# Altium project main board_Project.PrjPCB
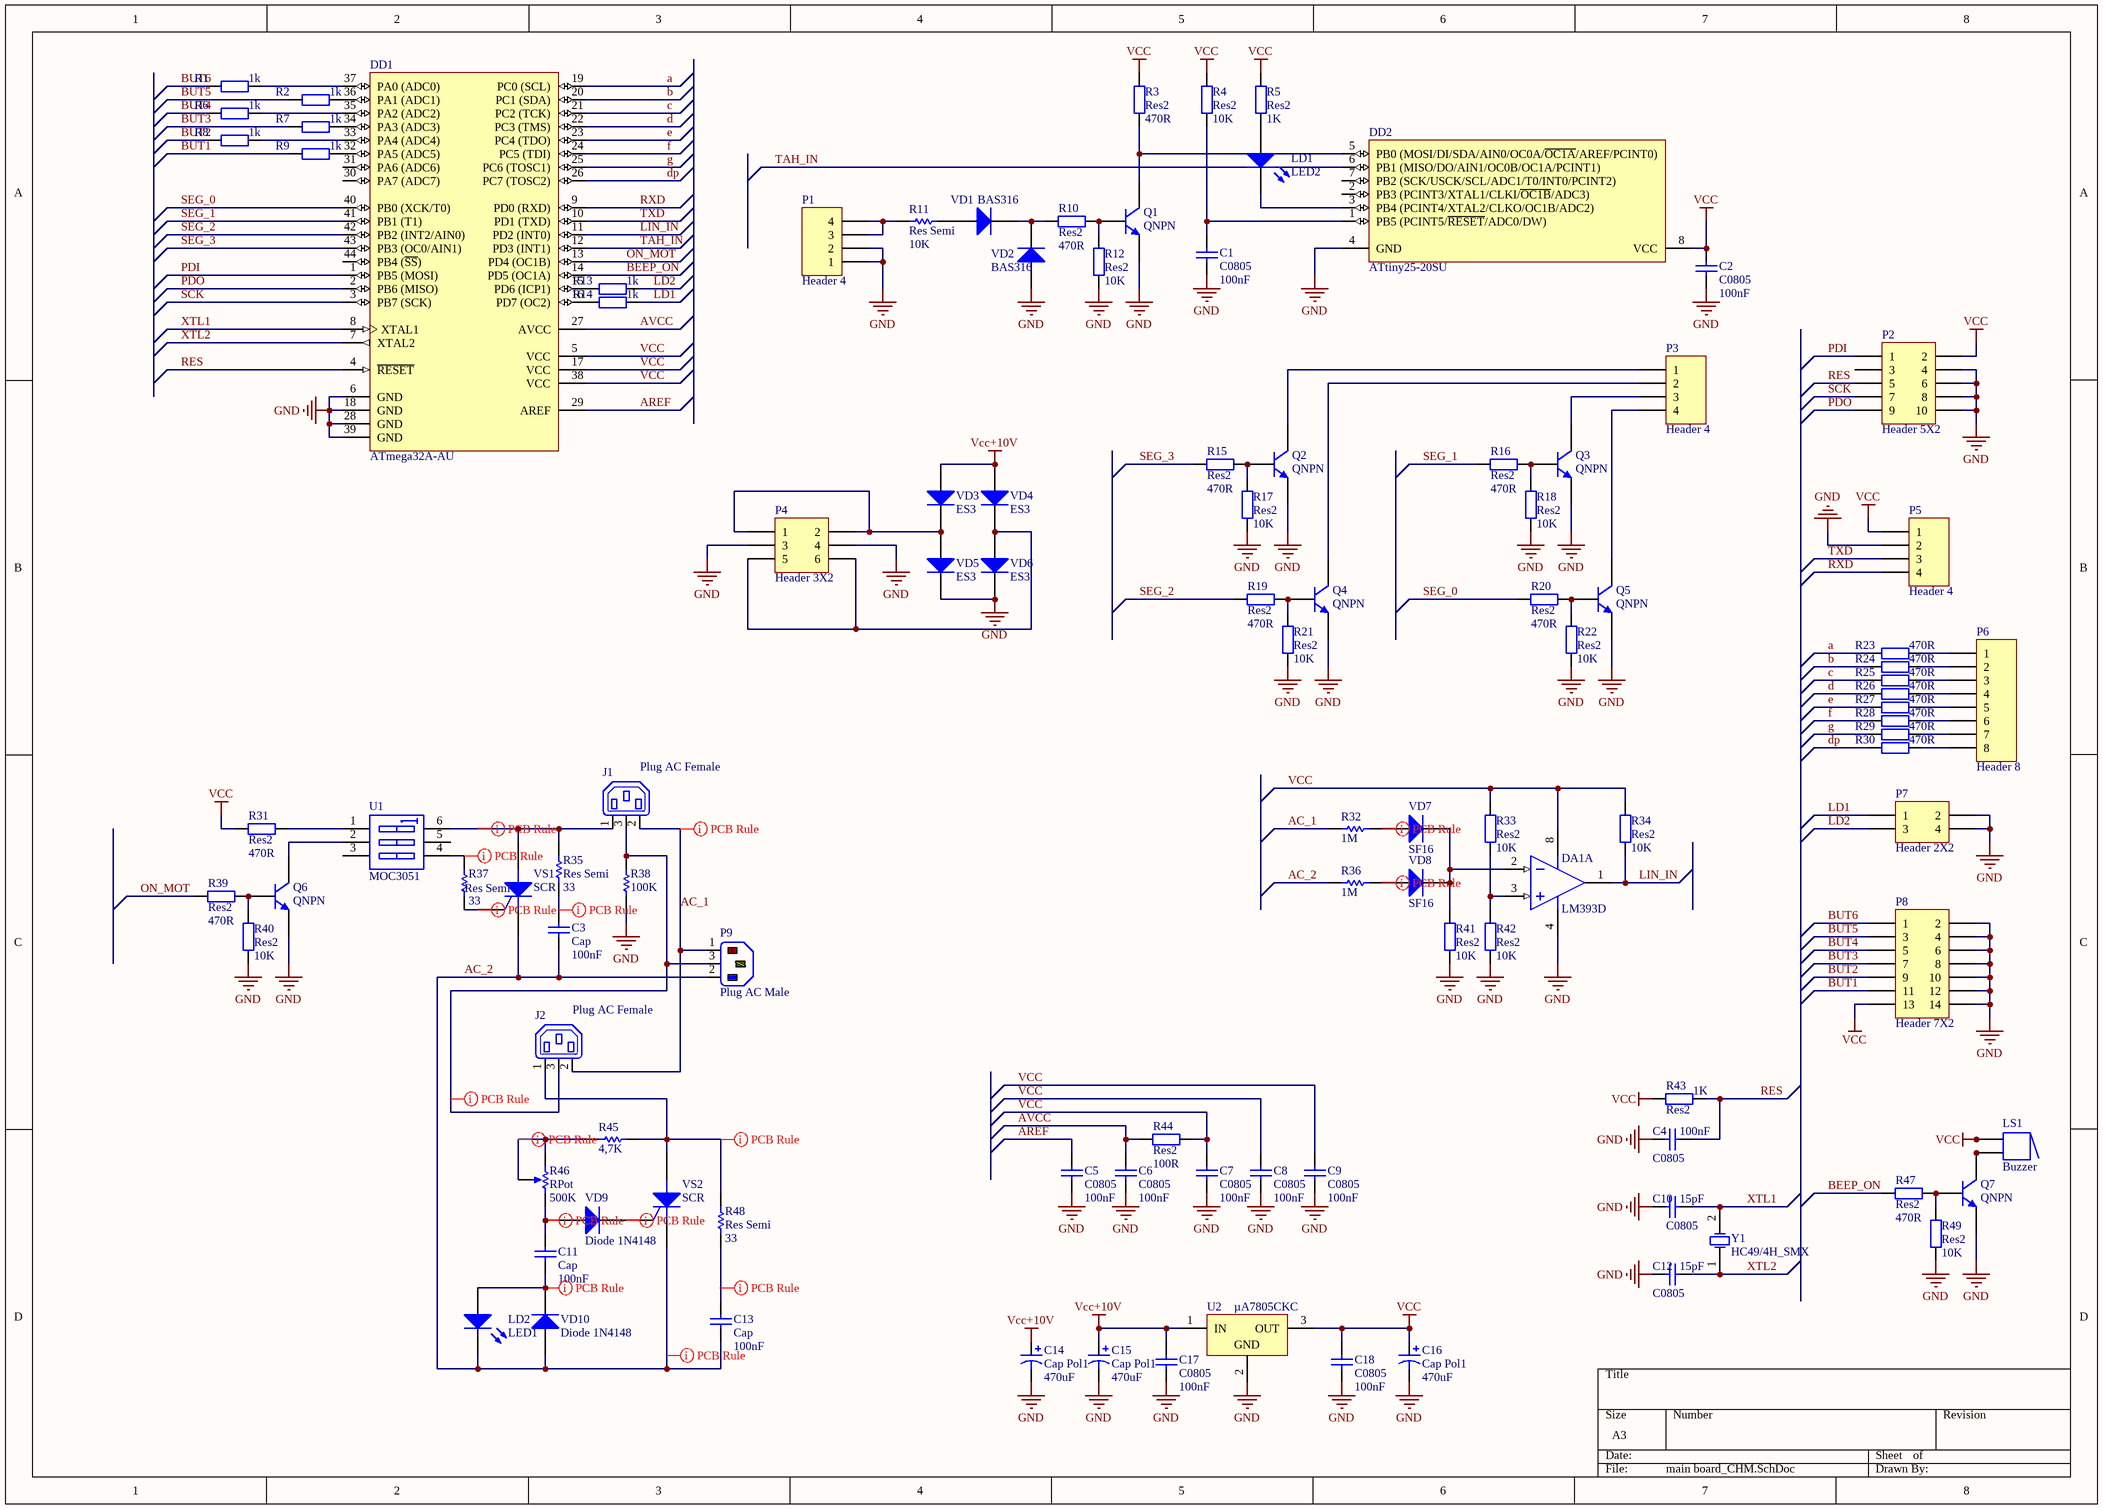
[diagram p0: main board_CHM.SchDoc]
1 sheet, 106 parts. Net scope: global (net labels, ports and power ports of the same name join across sheets).
Board file: main board_PCB.PcbDoc

## Sheet main board_CHM.SchDoc
size A3; PageSetup: Record=PageOptions|CenterHorizontal=True|CenterVertical=True|PrintScale=1.46|XCorrection=1.00|YCorrection=1.00|PrintKind=1|BorderSize=5000000|LeftOffset=0|BottomOffset=0|Orientation=2|PaperLength=5940|PaperWidth=4200|Scale=100|PaperSource=7|PrintQuality=600|MediaType=1|DitherType=10|PaperKind=A2|PrintScaleMode=1

### Parts
C1  C0805  value 100nF  [0805]
C2  C0805  value 100nF  [0805]
C3  Cap  value 100nF  [RAD-0.3]
C4  C0805  value 100nF  [0805]
C5  C0805  value 100nF  [0805]
C6  C0805  value 100nF  [0805]
C7  C0805  value 100nF  [0805]
C8  C0805  value 100nF  [0805]
C9  C0805  value 100nF  [0805]
C10  C0805  value 15pF  [0805]
C11  Cap  value 100nF  [RAD-0.3]
C12  C0805  value 15pF  [0805]
C13  Cap  value 100nF  [RAD-0.3]
C14  Cap Pol1  value 470uF  [RB5-10.5]
C15  Cap Pol1  value 470uF  [RB5-10.5]
C16  Cap Pol1  value 470uF  [RB5-10.5]
C17  C0805  value 100nF  [0805]
C18  C0805  value 100nF  [0805]
DA1  LM393D  [SO8_L]  (part A of 2)
DD1  ATmega32A-AU  [44A_N]
DD2  ATtiny25-20SU  [8S2_N]
J1  Plug AC Female  [SUPER-247]
J2  Plug AC Female  [Super-TO-247AC]
LD1  LED2  [3.2X1.6X1.1]
LD2  LED1  [HDR1X2]
LS1  Buzzer  [ABSM-1574]
P1  Header 4  [HDR1X4]
P2  Header 5X2  [HDR2X5]
P3  Header 4  [HDR1X4]
P4  Header 3X2  [HDR2X3]
P5  Header 4  [HDR1X4]
P6  Header 8  [HDR1X8]
P7  Header 2X2  [HDR2X2]
P8  Header 7X2  [HDR2X7]
P9  Plug AC Male  [Super-TO-247AC]
Q1  QNPN  [SOT23_M]
Q2  QNPN  [SOT23_M]
Q3  QNPN  [SOT23_M]
Q4  QNPN  [SOT23_M]
Q5  QNPN  [SOT23_M]
Q6  QNPN  [SOT23_M]
Q7  QNPN  [SOT23_M]
R1  value 1k  [6-0805_N]  (hidden comment: Res2)
R2  value 1k  [6-0805_N]  (hidden comment: Res2)
R3  Res2  value 470R  [6-0805_N]
R4  Res2  value 10K  [6-0805_N]
R5  Res2  value 1K  [6-0805_N]
R6  value 1k  [6-0805_N]  (hidden comment: Res2)
R7  value 1k  [6-0805_N]  (hidden comment: Res2)
R8  value 1k  [6-0805_N]  (hidden comment: Res2)
R9  value 1k  [6-0805_N]  (hidden comment: Res2)
R10  Res2  value 470R  [6-0805_N]
R11  Res Semi  value 10K  [AXIAL-0.5]
R12  Res2  value 10K  [6-0805_N]
R13  value 1k  [6-0805_N]  (hidden comment: Res2)
R14  value 1k  [6-0805_N]  (hidden comment: Res2)
R15  Res2  value 470R  [6-0805_N]
R16  Res2  value 470R  [6-0805_N]
R17  Res2  value 10K  [6-0805_N]
R18  Res2  value 10K  [6-0805_N]
R19  Res2  value 470R  [6-0805_N]
R20  Res2  value 470R  [6-0805_N]
R21  Res2  value 10K  [6-0805_N]
R22  Res2  value 10K  [6-0805_N]
R23  value 470R  [6-0805_N]  (hidden comment: Res2)
R24  value 470R  [6-0805_N]  (hidden comment: Res2)
R25  value 470R  [6-0805_N]  (hidden comment: Res2)
R26  value 470R  [6-0805_N]  (hidden comment: Res2)
R27  value 470R  [6-0805_N]  (hidden comment: Res2)
R28  value 470R  [6-0805_N]  (hidden comment: Res2)
R29  value 470R  [6-0805_N]  (hidden comment: Res2)
R30  value 470R  [6-0805_N]  (hidden comment: Res2)
R31  Res2  value 470R  [6-0805_N]
R32  value 1M  [AXIAL-0.5]  (hidden comment: Res Semi)
R33  Res2  value 10K  [6-0805_N]
R34  Res2  value 10K  [6-0805_N]
R35  Res Semi  value 33  [AXIAL-0.5]
R36  value 1M  [AXIAL-0.5]  (hidden comment: Res Semi)
R37  Res Semi  value 33  [AXIAL-0.5]
R38  value 100K  [AXIAL-0.5]  (hidden comment: Res Semi)
R39  Res2  value 470R  [6-0805_N]
R40  Res2  value 10K  [6-0805_N]
R41  Res2  value 10K  [6-0805_N]
R42  Res2  value 10K  [6-0805_N]
R43  Res2  value 1K  [6-0805_N]
R44  Res2  value 100R  [6-0805_N]
R45  value 4,7K  [AXIAL-0.5]  (hidden comment: Res Semi)
R46  RPot  value 500K  [VR5]
R47  Res2  value 470R  [6-0805_N]
R48  Res Semi  value 33  [AXIAL-0.5]
R49  Res2  value 10K  [6-0805_N]
U1  MOC3051  [DIP-6]
U2  µA7805CKC  [KC03]
VD1  BAS316  [SOD-323]
VD2  BAS316  [SOD-323]
VD3  ES3  [SMC]
VD4  ES3  [SMC]
VD5  ES3  [SMC]
VD6  ES3  [SMC]
VD7  SF16  [DO-41]
VD8  SF16  [DO-41]
VD9  Diode 1N4148  [DO-35]
VD10  Diode 1N4148  [DO-35]
VS1  SCR  [Super-TO-247AC]
VS2  SCR  [Super-TO-247AC]
Y1  HC49/4H_SMX  [HC49/4H_SMX]

### Nets
GND: C1.1 C2.1 C4.1 C5.1 C6.1 C7.1 C8.1 C9.1 C10.1 C12.1 C14.2 C15.2 C16.2 C17.1 C18.1 DA1.4(V-) DD1.6(GND) DD1.18(GND) DD1.28(GND) DD1.39(GND) DD2.4(GND) P1.1 P1.2 P2.4 P2.6 P2.8 P2.10 P4.3 P4.4 P5.2 P7.2 P7.4 P8.2 P8.4 P8.6 P8.8 P8.10 P8.12 P8.14 Q1.3(E) Q2.3(E) Q3.3(E) Q4.3(E) Q5.3(E) Q6.3(E) Q7.3(E) R12.1 R17.1 R18.1 R21.1 R22.1 R38.1 R40.1 R41.1 R42.1 R49.1 U2.2(GND) VD2.2(A) VD5.1(K) VD6.1(K)
VCC: C2.2 C7.2 C8.2 C9.2 C16.1 C18.2 DA1.8(V+) DD1.5(VCC) DD1.17(VCC) DD1.38(VCC) DD2.8(VCC) LS1.1 LS1.1A P2.2 P5.1 P8.13 R3.2 R4.2 R5.2 R31.1 R33.2 R34.2 R43.1 R44.2 U2.3(OUT)
Vcc+10V: C14.1 C15.1 C17.2 U2.1(IN) VD3.2(A) VD4.2(A)
a: DD1.19(PC0_(SCL)) R23.1
AC_1: J1.2(N) J2.2(N) P9.1(L) R32.1
AC_2: C3.1 C13.1 LD2.2(K) P9.2(N) R36.1 VD10.1(A) VS1.3(K) VS2.3(K)
AREF: C5.2 DD1.29(AREF)
AVCC: C6.2 DD1.27(AVCC) R44.1
b: DD1.20(PC1_(SDA)) R24.1
BEEP_ON: DD1.14(PD5_(OC1A)) R47.1
BUT1: P8.11 R9.1
BUT2: P8.9 R8.1
BUT3: P8.7 R7.1
BUT4: P8.5 R6.1
BUT5: P8.3 R2.1
BUT6: P8.1 R1.1
c: DD1.21(PC2_(TCK)) R25.1
d: DD1.22(PC3_(TMS)) R26.1
dp: DD1.26(PC7_(TOSC2)) R30.1
e: DD1.23(PC4_(TDO)) R27.1
f: DD1.24(PC5_(TDI)) R28.1
g: DD1.25(PC6_(TOSC1)) R29.1
LD1: P7.1 R14.2
LD2: P7.3 R13.2
LIN_IN: DA1.1(OUT) DD1.11(PD2_(INT0)) R34.1
ON_MOT: DD1.13(PD4_(OC1B)) R39.1
PDI: DD1.1(PB5_(MOSI)) P2.1
PDO: DD1.2(PB6_(MISO)) P2.9
RES: C4.2 DD1.4(~{RESET}) P2.5 R43.2
RXD: DD1.9(PD0_(RXD)) P5.4
SCK: DD1.3(PB7_(SCK)) P2.7
SEG_0: DD1.40(PB0_(XCK/T0)) R20.1
SEG_1: DD1.41(PB1_(T1)) R16.1
SEG_2: DD1.42(PB2_(INT2/AIN0)) R19.1
SEG_3: DD1.43(PB3_(OC0/AIN1)) R15.1
TAH_IN: DD1.12(PD3_(INT1)) DD2.6(PB1_(MISO/DO/AIN1/OC0B/OC1A/PCINT1))
TXD: DD1.10(PD1_(TXD)) P5.3
XTL1: C10.2 DD1.8(XTAL1) Y1.2(OSC2)
XTL2: C12.2 DD1.7(XTAL2) Y1.1(OSC1)
NetC1_2: C1.2 DD2.1(PB5_(PCINT5/~{RESET}/ADC0/DW)) R4.1
NetC3_2: C3.2 R35.1
NetC11_1: C11.1 LD2.1(A) VD10.2(K)
NetC11_2: C11.2 R46.2(BOT) VD9.1(A)
NetC13_2: C13.2 R48.1
NetDA1_2: DA1.2(IN-) R41.2 VD7.2(K) VD8.2(K)
NetDA1_3: DA1.3(IN+) R33.1 R42.2
NetDD1_15: DD1.15(PD6_(ICP1)) R13.1
NetDD1_16: DD1.16(PD7_(OC2)) R14.1
NetDD1_32: DD1.32(PA5_(ADC5)) R9.2
NetDD1_33: DD1.33(PA4_(ADC4)) R8.2
NetDD1_34: DD1.34(PA3_(ADC3)) R7.2
NetDD1_35: DD1.35(PA2_(ADC2)) R6.2
NetDD1_36: DD1.36(PA1_(ADC1)) R2.2
NetDD1_37: DD1.37(PA0_(ADC0)) R1.2
NetDD2_3: DD2.3(PB4_(PCINT4/XTAL2/CLKO/OC1B/ADC2)) LD1.2(K)
NetDD2_5: DD2.5(PB0_(MOSI/DI/SDA/AIN0/OC0A/~{OC1A}/AREF/PCINT0)) Q1.1(C) R3.1
NetJ1_1: J1.1(L) R35.2 U1.6(B1) VS1.1(A)
NetJ1_3: J1.3(E) J2.3(E) P9.3(E) R38.2
NetJ2_1: J2.1(L) R45.2 R48.2 VS2.1(A)
NetLD1_1: LD1.1(A) R5.1
NetLS1_2: LS1.2 LS1.2A Q7.1(C)
NetP1_3: P1.3 P1.4 R11.1
NetP3_1: P3.1 Q2.1(C)
NetP3_2: P3.2 Q4.1(C)
NetP3_3: P3.3 Q3.1(C)
NetP3_4: P3.4 Q5.1(C)
NetP4_1: P4.1 P4.2 VD3.1(K) VD5.2(A)
NetP4_5: P4.5 P4.6 VD4.1(K) VD6.2(A)
NetP6_1: P6.1 R23.2
NetP6_2: P6.2 R24.2
NetP6_3: P6.3 R25.2
NetP6_4: P6.4 R26.2
NetP6_5: P6.5 R27.2
NetP6_6: P6.6 R28.2
NetP6_7: P6.7 R29.2
NetP6_8: P6.8 R30.2
NetQ1_2: Q1.2(B) R10.2 R12.2
NetQ2_2: Q2.2(B) R15.2 R17.2
NetQ3_2: Q3.2(B) R16.2 R18.2
NetQ4_2: Q4.2(B) R19.2 R21.2
NetQ5_2: Q5.2(B) R20.2 R22.2
NetQ6_1: Q6.1(C) U1.2(A2)
NetQ6_2: Q6.2(B) R39.2 R40.2
NetQ7_2: Q7.2(B) R47.2 R49.2
NetR10_1: R10.1 VD1.1(K) VD2.1(K)
NetR11_2: R11.2 VD1.2(A)
NetR31_2: R31.2 U1.1(A1)
NetR32_2: R32.2 VD7.1(A)
NetR36_2: R36.2 VD8.1(A)
NetR37_1: R37.1 VS1.2(G)
NetR37_2: R37.2 U1.4(B3)
NetR45_1: R45.1 R46.1(TOP) R46.3(TAP)
NetVD9_2: VD9.2(K) VS2.2(G)

Not connected (* = marked no-connect by the designer): DD1 30(PA7_(ADC7)) 31(PA6_(ADC6)) 44(PB4_(~{SS})); DD2 2(PB3_(PCINT3/XTAL1/CLKI/~{OC1B}/ADC3)) 7(PB2_(SCK/USCK/SCL/ADC1/T0/INT0/PCINT2)); P2 3; U1 3(A3) 5(B2)

### Layout directives
rule Undefined; rule Width Constraint [Pref Width = 40mil    Min Width = 10mil    Max Width = 50mil]: AC_1, AC_2, NetC3_2, NetC11_1, NetC11_2, NetC13_2, NetJ1_1, NetJ1_3, NetJ2_1, NetR32_2, NetR36_2, NetR37_1, NetR37_2, NetR45_1, NetVD9_2

### Library data of the parts
C1 C2 C4-C10 C12 C17 C18 = C0805: Ceramic Chip Capacitor - Standard; Note: Footprint corresponds to dimensions for bulk cassette packaging. This case size has tightened tolerances.; Published: 17-Jul-2002; LatestRevisionDate: 19-Mar-2004; LatestRevisionNote: Silkscreen size reduced.; DatasheetDocument: Mar-2001; PackageDocument: Mar-2001; PackageReference: 0805; Publisher: Altium Limited; Code_JEITA: 0805; Code_IPC: 2012[0805]; ComponentLink1Description: Manufacturer Link; ComponentLink1URL: http://www.kemet.com/; ComponentLink2Description: Datasheet; ComponentLink2URL: http://www.kemet.com/kemet/web/homepage/kechome.nsf/vapubfilesname/F3102TA.pdf/$file/F3102TA.pdf
C3 C11 C13 = Cap: Capacitor; Published: 8-Jun-2000; LatestRevisionDate: 17-Jul-2002; LatestRevisionNote: Re-released for DXP Platform.; PackageReference: RAD-0.3; Publisher: Altium Limited; PackageDescription: Radial Cap, Thru-Hole; 2 Leads; 0.3 in Pin Spacing
C14-C16 = Cap Pol1: Polarized Capacitor (Radial); Published: 8-Jun-2000; LatestRevisionDate: 17-Jul-2002; LatestRevisionNote: Re-released for DXP Platform.; PackageReference: RB7.6-15; Publisher: Altium Limited; PackageDescription: Polarized Capacitor (Radial); 2 Leads
DA1 = LM393D: Low-Power Dual Voltage Comparator; Published: 24-Aug-2001; LatestRevisionDate: 13-Apr-2006; LatestRevisionNote: IPC-7351 Footprint Added.; DatasheetVersion: Jun-1998; PackageVersion: Dec-2002; PackageReference: SO8; Publisher: Altium Limited; PackageDescription: 8-Pin Small Outline Integrated Circuit 1.27 mm Pitch; Code_JEDEC: MS-012-AA; Code_IPC: SOIC127P600-8; ComponentLink1Description: Manufacturer Link; ComponentLink1URL: http://www.st.com/; ComponentLink2Description: Datasheet; ComponentLink2URL: http://www.st.com/stonline/products/literature/ds/2164/lm293.pdf
DD1 = ATmega32A-AU: 8-bit AVR Microcontroller, 32KB Flash, 1KB EEPROM, 2KB SRAM, 44-pin TQFP, Industrial Grade (-40°C to 85°C); Published: 1-Apr-2010; DatasheetVersion: revB, Jul-2009; PackageVersion: rev.B, Oct-2001; PackageReference: 44A; Publisher: Altium Limited; PackageDescription: 44-Pin Plastic Thin Profile Quad Flat Pack, 10 x 10 x 1.0 mm Body, 0.8 mm Pitch (TQFP); Supplier 1: Digi-Key; Supplier Part Number 1: ATMEGA32A-AU-ND; Supplier 2: Farnell; Supplier Part Number 2: 1704563; Supplier 3: Mouser; Supplier Part Number 3: 556-ATMEGA32A-AU; ComponentLink1Description: Manufacturer Link; ComponentLink1URL: http://www.atmel.com/products/avr/default.asp?; ComponentLink2Description: ATmega32A Datasheet; ComponentLink2URL: http://www.atmel.com/dyn/resources/prod_documents/doc8155.pdf; ComponentLink3Description: ATmega32A Summary; ComponentLink3URL: http://www.atmel.com/dyn/resources/prod_documents/8155S.pdf; ComponentLink4Description: Atmel.com Home; ComponentLink4URL: http://www.atmel.com
DD2 = ATtiny25-20SU: 8-bit AVR Microcontroller, 2.7-5.5V, 2KB Flash, 128 Bytes EEPROM, 128 Bytes SRAM, 8-pin SOP, Industrial Grade (-40°C to 85°C), Pb-Free; Published: 1-Apr-2010; DatasheetVersion: revK, Jan-2008; PackageVersion: revF, Apr-2008; PackageReference: 8S2; Publisher: Altium Limited; PackageDescription: 8-Lead, 0.208" Body, Plastic Small Outline Package (EIAJ); Supplier 1: Digi-Key; Supplier Part Number 1: ATTINY25-20SU-ND; Supplier 2: Farnell; Supplier Part Number 2: 1455143; Supplier 3: Mouser; Supplier Part Number 3: 556-ATTINY25-20SU; ComponentLink1Description: Manufacturer Link; ComponentLink1URL: http://www.atmel.com/products/avr/default.asp?; ComponentLink2Description: ATtiny25/45/85 Datasheet; ComponentLink2URL: http://www.atmel.com/dyn/resources/prod_documents/doc2586.pdf; ComponentLink3Description: ATtiny25/45/85 Summary; ComponentLink3URL: http://www.atmel.com/dyn/resources/prod_documents/2586S.pdf; ComponentLink4Description: Atmel.com Home; ComponentLink4URL: http://www.atmel.com
J1 J2 = Plug AC Female: IEC Mains Power Outlet, EN60 320-2-2 F Class I, PC Flange Rear Mount, Chassis Socket; PackageDocument: ver.80, 15-Sep-2003; MaximumRating: 10A, 250V a.c. (UL & CSA 15A, 250V a.c.); MountingFixtures: Not drawn on schematic symbol.; PCB_Layout: Complies with manufacturer's recommendation.; DrillSize: Corresponds to nominal value.; Published: 15-Jul-2004; LatestRevisionDate: 15-Jul-2004; LatestRevisionNote: Component Replaced & renamed from "Phonejack".; DatasheetDocument: ver.80, 15-Sep-2003; PackageReference: PX0675/PC; Publisher: Altium Limited; Terminations: P.C. Spills; ComponentLink1Description: Manufacturer Link; ComponentLink1URL: http://www.bulgin.co.uk/
LD1 = LED2: Typical RED, GREEN, YELLOW, AMBER GaAs LED; Published: 8-Jun-2000; LatestRevisionDate: 17-Jul-2002; LatestRevisionNote: Re-released for DXP Platform.; PackageVersion: Feb-2002; PackageReference: 3.2X1.6X1.1; Publisher: Altium Limited; PackageDescription: SM LED; 2 Flat Leads
LD2 = LED1: Typical RED GaAs LED; Published: 8-Jun-2000; LatestRevisionDate: 08-Jul-2005; LatestRevisionNote: Mech Layer 1 removed.; PackageReference: LED-1; Publisher: Altium Limited; PackageDescription: LED; 2 Leads
LS1 = Buzzer: Magnetic Transducer Buzzer; Published: 24-Mar-1999; LatestRevisionDate: 17-Dec-2003; LatestRevisionNote: Schematic revised, PCB Footprint replaced.; DatasheetVersion: 17-Dec-2003; PackageReference: ABSM-1574; Publisher: Altium Limited; PackageDescription: Magnetic Transducer Buzzer; ComponentLink1Description: Manufacturer Link; ComponentLink1URL: http://www.megastar.com/linecard/buzzmode/index.php
P1 P3 P5 = Header 4: Header, 4-Pin; LatestRevisionDate: 17-Jul-2002; LatestRevisionNote: Re-released for DXP Platform.; Publisher: Altium Limited
P2 = Header 5X2: Header, 5-Pin, Dual row; LatestRevisionDate: 17-Jul-2002; LatestRevisionNote: Re-released for DXP Platform.; Publisher: Altium Limited
P4 = Header 3X2: Header, 3-Pin, Dual row; LatestRevisionDate: 17-Jul-2002; LatestRevisionNote: Re-released for DXP Platform.; Publisher: Altium Limited
P6 = Header 8: Header, 8-Pin; LatestRevisionDate: 17-Jul-2002; LatestRevisionNote: Re-released for DXP Platform.; Publisher: Altium Limited
P7 = Header 2X2: Header, 2-Pin, Dual row; LatestRevisionDate: 17-Jul-2002; LatestRevisionNote: Re-released for DXP Platform.; Publisher: Altium Limited
P8 = Header 7X2: Header, 7-Pin, Dual row; LatestRevisionDate: 17-Jul-2002; LatestRevisionNote: Re-released for DXP Platform.; Publisher: Altium Limited
P9 = Plug AC Male: IEC Mains Power Inlet, EN60 320-1 C14 Class I Cold Condition, PC Flange Rear Mount, Chassis Plug; PackageDocument: ver.80, 15-Sep-2003; MaximumRating: 10A, 250V a.c. (UL & CSA 15A, 250V a.c.); MountingFixtures: Not drawn on schematic symbol.; PCB_Layout: Complies with manufacturer's recommendation.; DrillSize: Corresponds to nominal value.; Note: IEC Color Scheme employed for L, N and E.; Published: 15-Jul-2004; LatestRevisionDate: 15-Jul-2004; LatestRevisionNote: Component Replaced.; DatasheetDocument: ver.80, 15-Sep-2003; PackageReference: PX0580/PC; Publisher: Altium Limited; Terminations: P.C. Spills; ComponentLink1Description: Manufacturer Link; ComponentLink1URL: http://www.bulgin.co.uk/
Q1-Q7 = QNPN: NPN Bipolar Transistor; pin to pad: 2>3 3>2; Published: 8-Jun-2000; LatestRevisionDate: 29-May-2009; LatestRevisionNote: IPC-7351 Footprint Added.; PackageVersion: Aug-1999; PackageReference: SOT-23B; Publisher: Altium Limited; PackageDescription: 3-Pin SOT-23 Package 0.95 mm Pitch, 2.4 mm Lead Span
R1-R10 R12-R31 R33 R34 R39-R44 R47 R49 = Res2: Resistor; Published: 8-Jun-2000; LatestRevisionDate: 17-Jul-2002; LatestRevisionNote: Re-released for DXP Platform.; PackageReference: AXIAL-0.4; Publisher: Altium Limited; PackageDescription: Axial Device, Thru-Hole; 2 Leads; 0.4 in Pin Spacing
R11 R32 R35-R38 R45 R48 = Res Semi: Semiconductor Resistor; Published: 8-Jun-2000; LatestRevisionDate: 17-Jul-2002; LatestRevisionNote: Re-released for DXP Platform.; PackageReference: AXIAL-0.5; Publisher: Altium Limited; PackageDescription: Axial Device, Thru-Hole; 2 Leads; 0.5 in Pin Spacing
R46 = RPot: Potentiometer; pin to pad: 1>2 2>1; Sim Note: Enter the Resistance value and the set point into parameter fields.; Set Position: 0.5; Published: 8-Jun-2000; LatestRevisionDate: 17-Jul-2002; LatestRevisionNote: Re-released for DXP Platform.; PackageReference: VR5; Publisher: Altium Limited; PackageDescription: Variable Resistor, Thru-Hole; 3 Leads
U1 = SW DIP-3: DIP Switch, 3 Position, SPST; Published: 24-Mar-1999; LatestRevisionDate: 17-Jul-2002; LatestRevisionNote: Re-released for DXP Platform.; PackageReference: DIP-6; Publisher: Altium Limited; Code_JEDEC: MO-001-AM
U2 = µA7805CKC: Positive-Voltage Regulator; Note: Pin 2 is electrically connected to TAB.; Published: 15-Apr-2002; DatasheetVersion: Jul-1999; PackageVersion: Sep-1995; PackageReference: KC03; Publisher: Altium Limited; PackageDescription: TO, Thru-Hole, Vertical, Heatsink Mounted; 3 In-Line Leads; Pitch 2.54 mm; ComponentLink1Description: Manufacturer Link; ComponentLink1URL: http://www.ti.com/; ComponentLink2Description: Datasheet; ComponentLink2URL: http://www-s.ti.com/sc/ds/ua7805.pdf
VD1-VD6 = BA592: Silicon RF Switching Diode for VHF Band Switching in TV/VTR Tuners; Published: 21-Mar-2003; LatestRevisionDate: 19-Mar-2004; LatestRevisionNote: Silkscreen size reduced.; DatasheetDocument: Oct-1999; PackageDocument: Sep-2000; PackageReference: SOD-323; Publisher: Altium Limited; ComponentLink1Description: Manufacturer Link; ComponentLink1URL: http://www.infineon.com/; ComponentLink2Description: Datasheet; ComponentLink2URL: http://www.infineon.com/upload/Document/cmc_upload/documents/080/120/ba592_ba892series_1.pdf
VD7 VD8 = Diode 1N4001: 1 Amp General Purpose Rectifier; Published: 8-Jun-2000; LatestRevisionDate: 17-Jul-2002; LatestRevisionNote: Re-released for DXP Platform.; DatasheetVersion: 1998; PackageVersion: Aug-1999; PackageReference: DO-41; Publisher: Altium Limited; PackageDescription: Diode, Axial; Body 5.2 x 2.7 mm (LxDia. max), Lead Dia. 0.86 mm (max); Code_JEDEC: DO-204-AL; ComponentLink1Description: Manufacturer Link; ComponentLink1URL: http://www.fairchildsemi.com/; ComponentLink2Description: Datasheet; ComponentLink2URL: http://www.fairchildsemi.com/ds/1N%2F1N4001.pdf
VD9 VD10 = Diode 1N4148: High Conductance Fast Diode; Published: 8-Jun-2000; LatestRevisionDate: 17-Jul-2002; LatestRevisionNote: Re-released for DXP Platform.; DatasheetVersion: 1997; PackageReference: DO-35; Publisher: Altium Limited; PackageDescription: Diode, Axial; Body 3.8 x 1.9 mm (LxDia. max), Lead Dia. 0.53 mm (max); Code_JEDEC: DO-204-AH; ComponentLink1Description: Manufacturer Link; ComponentLink1URL: http://www.fairchildsemi.com/; ComponentLink2Description: Datasheet; ComponentLink2URL: http://www.fairchildsemi.com/ds/1N%2F1N4148.pdf
VS1 VS2 = SCR: Silicon Controlled Rectifier; Published: 8-Jun-2000; LatestRevisionDate: 17-Jul-2002; LatestRevisionNote: Re-released for DXP Platform.; PackageReference: TO-220-AB; Publisher: Altium Limited; Code_JEDEC: TO-220-AB
Y1 = HC49/4H_SMX: Surface Mount Quartz Crystal; Note: PCB layout complies with manufacturer's recommendation.; Published: 17-Jul-2002; DatasheetDocument: 18-Oct-1999; PackageDocument: 18-Oct-1999; PackageReference: HC49/4H_SMX; Publisher: Altium Limited; ComponentLink1Description: Manufacturer Link; ComponentLink1URL: http://www.cmac.com/mt/; ComponentLink2Description: Datasheet; ComponentLink2URL: http://www.cmac.com/mt/databook/crystals/smd/hc49_4h_smx.pdf